# Altium project HVPowerModule.PrjPcb
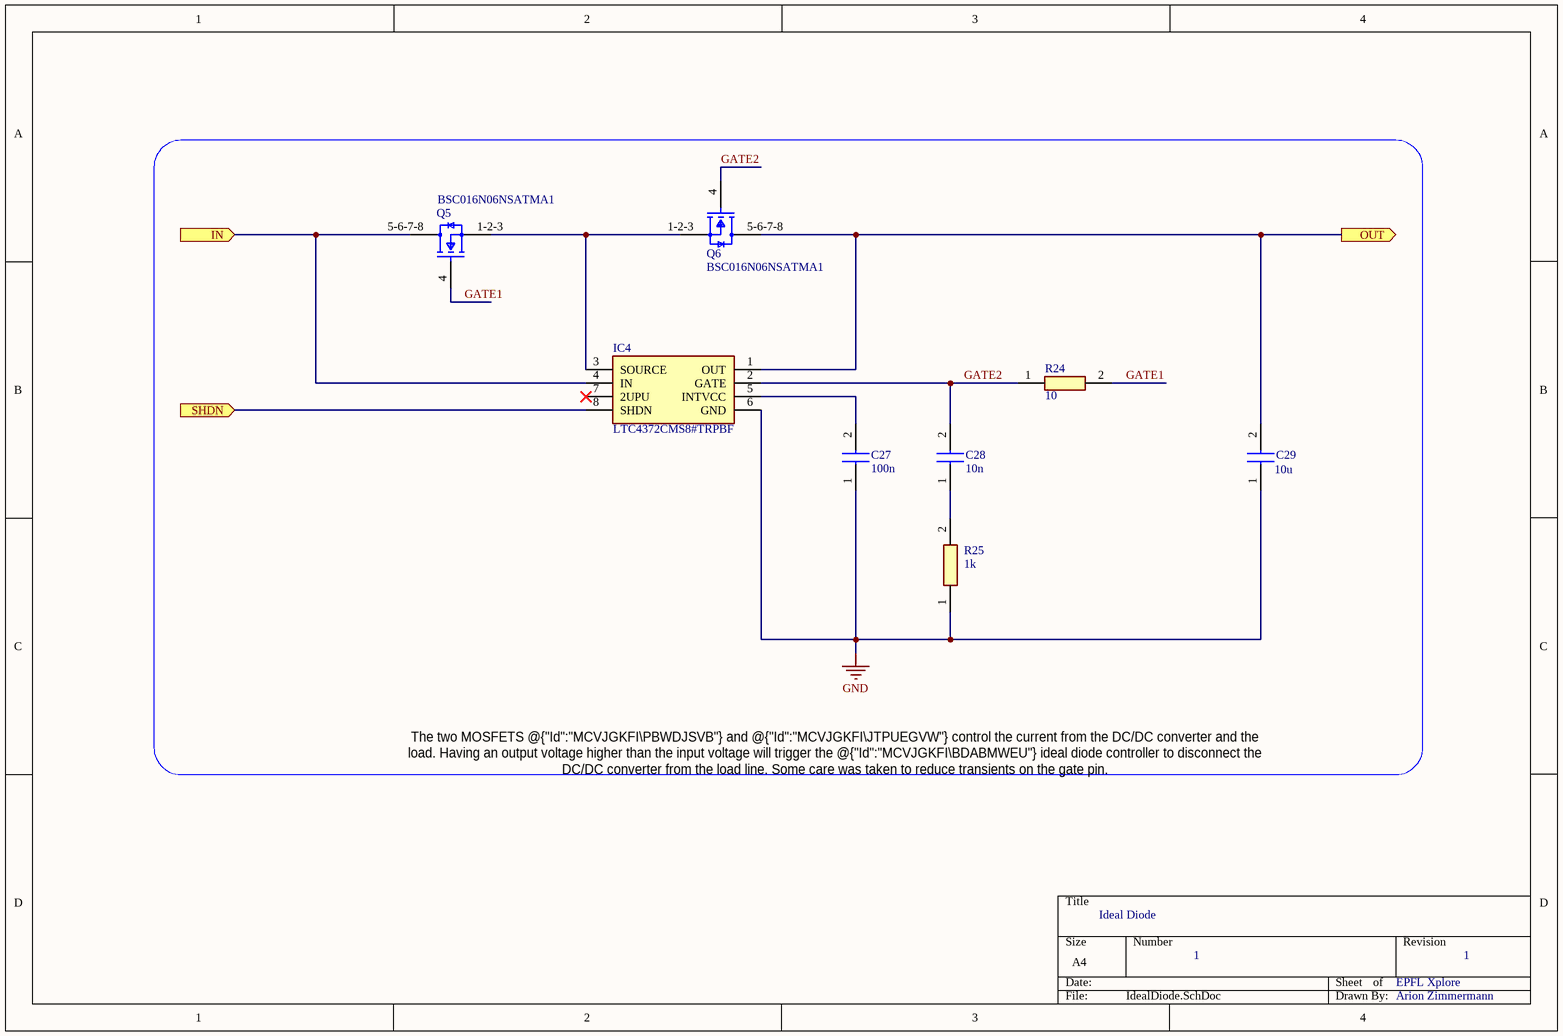
[diagram p0: IdealDiode.SchDoc]
3 sheets, 49 parts. Net scope: hierarchical (ports join the sheet entries above them; power ports are global).
Board file: HVPowerModule.PcbDoc
Sheets:
  IdealDiode.SchDoc
  DAC.SchDoc
  Converter.SchDoc

## Sheet IdealDiode.SchDoc
size A4; SheetNumber: 4; SheetTotal: 4

### Parts
C27  value 100n  [CAPC1608X95N]  (hidden comment: C0603C104K5RACTU)
C28  value 10n  [CAPC1608X95N]  (hidden comment: C0603C103K5RACTU)
C29  value 10u  [CAPC3225X230N]  (hidden comment: C3225X7R2A106K250AC)
IC4  LTC4372CMS8#TRPBF  [SOP65P490X110-8N]
Q5  BSC016N06NSATMA1  [FP-PG-TDSON-8-MFG]
Q6  BSC016N06NSATMA1  [FP-PG-TDSON-8-MFG]
R24  value 10  [RESC1608X55N]  (hidden comment: CRCW060310R0JNEAC)
R25  value 1k  [RESC1608X55N]  (hidden comment: CRCW06031K00FKECC)

### Ports
IN (in), OUT (out), SHDN (in)

### Nets
GND: C27.1 C29.1 IC4.6(GND) R25.1
GATE1: Q5.4(G) R24.2
GATE2: C28.2 IC4.2(GATE) Q6.4(G) R24.1
NetC27_2: C27.2 IC4.5(INTVCC)
NetC28_1: C28.1 R25.2
NetC29_2: C29.2 IC4.1(OUT) Q6.5-6-7-8(D) ; port OUT
NetIC4_3: IC4.3(SOURCE) Q5.1-2-3(S) Q6.1-2-3(S)
NetIC4_4: IC4.4(IN) Q5.5-6-7-8(D) ; port IN
NetIC4_8: IC4.8(SHDN) ; port SHDN

Not connected (* = marked no-connect by the designer): IC4 7(2UPU)*

### Notes on the sheet
- The two MOSFETS @{"Id":"MCVJGKFI\PBWDJSVB"} and @{"Id":"MCVJGKFI\JTPUEGVW"} control the current from the DC/DC converter and the load. Having an output voltage higher than the input voltage will trigger the @{"Id":"MCVJGKFI\BDABMWEU"} ideal diode controller to disconnect the DC/DC converter from the load line. Some care was taken to reduce transients on the gate pin.
- Ideal Diode
- 1
- EPFL Xplore
- Arion Zimmermann

### Library data of the parts
C27 C28 = C0603C104K5RACTU: Capacitor; Manufacturer_Name: Kemet; Datasheet Link: http://www.farnell.com/datasheets/2205446.pdf; Height: 0.95mm; Manufacturer_Part_Number: C0603C104K5RACTU; Mouser Part Number: 80-C0603C104K5R; Mouser Price/Stock: https://www.mouser.co.uk/ProductDetail/KEMET/C0603C104K5RACTU?qs=l5k%252BbMnNDkkVcnZPSAaaiQ%3D%3D; Arrow Part Number: C0603C104K5RACTU; Arrow Price/Stock: https://www.arrow.com/en/products/c0603c104k5ractu/kemet-corporation; Supplier 1: Mouser; Supplier Part Number 1: 80-C0603C104K5R
C29 = C3225X7R2A106K250AC: Capacitor; Manufacturer_Name: TDK; Datasheet Link: https://product.tdk.com/info/en/catalog/datasheets/mlcc_commercial_midvoltage_en.pdf; Height: 2.3mm; Manufacturer_Part_Number: C3225X7R2A106K250AC; Mouser Part Number: 810-C3225X7R2A106K25; Mouser Price/Stock: https://www.mouser.co.uk/ProductDetail/TDK/C3225X7R2A106K250AC?qs=rSMjJ%252B1ewcQNu1nTZev8UA%3D%3D
IC4 = LTC4372CMS8#TRPBF: Integrated Circuit; Manufacturer_Name: Analog Devices; Datasheet Link: https://www.arrow.com/en/products/ltc4372cms8trpbf/analog-devices; Height: 1.1mm; Manufacturer_Part_Number: LTC4372CMS8#TRPBF; Mouser Part Number: 584-LTC4372CMS8TRPBF; Mouser Price/Stock: https://www.mouser.co.uk/ProductDetail/Analog-Devices/LTC4372CMS8TRPBF?qs=T94vaHKWudSmRk6S7wUTVw%3D%3D; Arrow Part Number: LTC4372CMS8#TRPBF; Arrow Price/Stock: https://www.arrow.com/en/products/ltc4372cms8trpbf/analog-devices; Supplier 1: Mouser; Supplier Part Number 1: 584-LTC4372CMS8TRPBF
Q5 Q6 = CMP-32901-000166-1: MOSFET N-CH 60V 30A TDSON-8; Manufacturer: Infineon; Reverse Recovery Charge: 78nC; Power Dissipation: 2.5W; Transconductance: 140S; Gate Charge At Vgs: 71nC @ 10V; Turn On Delay Time: 19ns; Number Of Channels: 1; Typ Forward Diode Voltage: 0.9V; Depletion Mode: False; Max Forward Diode Voltage: 1.2V; Reverse Recovery Time: 61ns; Input Capacitace At Vds: 5200pF @ 30V; Gate To Source Voltage: 20V; Threshold Vgs Min: 2.1V; Drain To Source Resistance: 1.4mΩ; Turn Off Delay Time: 35ns; Threshold Vgs Max: 3.3V; Pulse Drain Current: 400A; Rthja Max: 50K/W; Max Junction Temp: +150°C; Temperature Range High: +150°C; Lead Free: Yes; ComponentLink2URL: https://www.infineon.com/dgdl/Infineon-BSC016N06NS-DS-v02_01-en.pdf?fileId=db3a3043353fdc160135532b353c483c; Device Class L2: Transistors; Drain To Source Voltage: 60V; ComponentLink2Description: Datasheet; Device Class L1: Discrete Semiconductors; Drain To Source Breakdown Voltage: 60V; Manufacturer Part Number: BSC016N06NSATMA1; Continuous Drain Current: 30A; Package: PG-TDSON-8; Octopart: https://octopart.com/bsc016n06nsatma1-infineon-23421881; Automotive: No; Temperature Range Low: -55°C; Footprint Url: https://www.infineon.com/cms/en/product/packages/PG-TDSON/PG-TDSON-8-17/; RoHS: TRUE; Number Of N Channels: 1; Temperature: -55°C to +150°C; Height: 1.1mm; Device Class L3: MOSFETs; Category: Trans; Digikey Description: MOSFET N-CH 60V 30A TDSON-8
R24 R25 = CRCW0603100RFKEBC: Resistor; Manufacturer_Name: Vishay; Datasheet Link: https://www.vishay.com/docs/28773/crcwce3.pdf; Height: 0.55mm; Manufacturer_Part_Number: CRCW0603100RFKEBC; Mouser Part Number: 71-CRCW0603100RFKEBC; Mouser Price/Stock: https://www.mouser.co.uk/ProductDetail/Vishay-Dale/CRCW0603100RFKEBC?qs=wd5RIQLrsJhdvQFtBw4oWg%3D%3D; Arrow Part Number: CRCW0603100RFKEBC; Arrow Price/Stock: https://www.arrow.com/en/products/crcw0603100rfkebc/vishay?region=nac

## Sheet DAC.SchDoc
size A4; SheetNumber: 3; SheetTotal: 4
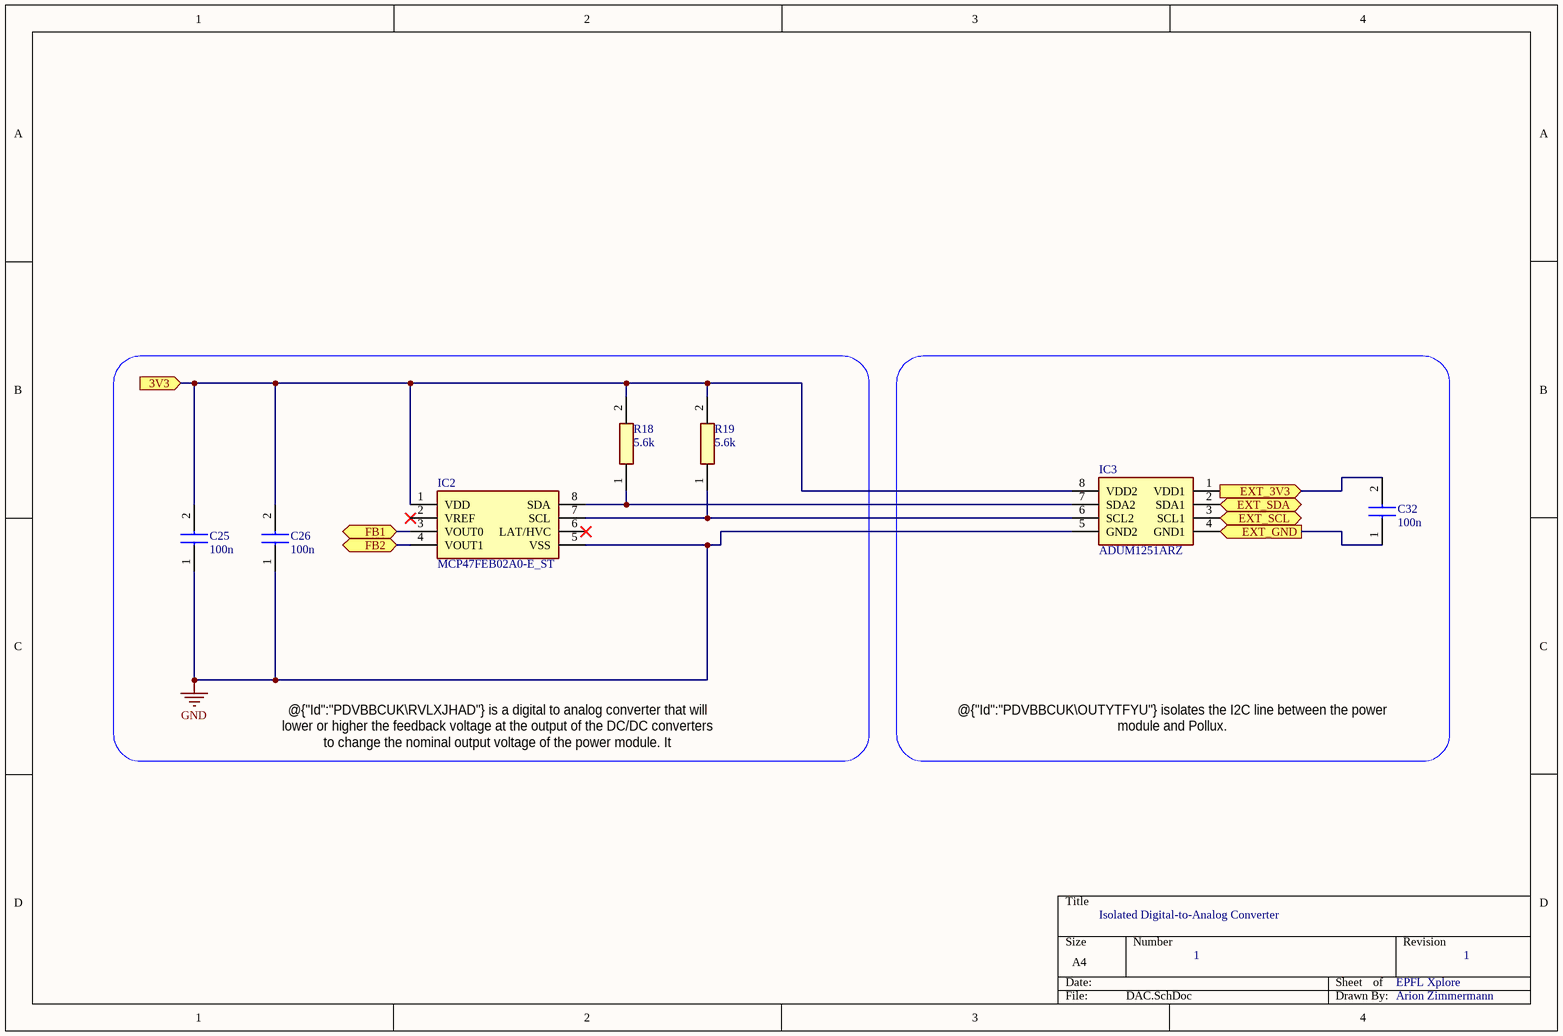
[diagram p1: DAC.SchDoc]

### Parts
(Parts that share a designator on the sheet are numbered #1, #2 ... from top to bottom, then left to right.)
C25  value 100n  [CAPC1608X95N]  (hidden comment: C0603C104K5RACTU)
C26#1  value 100n  [CAPC1608X95N]  (hidden comment: C0603C104K5RACTU)
C32  value 100n  [CAPC1608X95N]  (hidden comment: C0603C104K5RACTU)
IC2  MCP47FEB02A0-E_ST  [SOP65P640X120-8N]
IC3  ADUM1251ARZ  [SOIC127P600X175-8N]
R18  value 5.6k  [RESC1608X50N]  (hidden comment: CRCW06035K60JNEAC)
R19  value 5.6k  [RESC1608X50N]  (hidden comment: CRCW06035K60JNEAC)

### Ports
3V3 (in), EXT_3V3 (in), EXT_GND (out), EXT_SCL (bidir), EXT_SDA (bidir), FB1 (bidir), FB2 (bidir)

### Nets
GND: C25.1 C26#1.1 IC2.5(VSS) IC3.5(GND2)
NetC25_2: C25.2 C26#1.2 IC2.1(VDD) IC3.8(VDD2) R18.2 R19.2 ; port 3V3
NetC32_1: C32.1 IC3.4(GND1) ; port EXT_GND
NetC32_2: C32.2 IC3.1(VDD1) ; port EXT_3V3
NetIC2_3: IC2.3(VOUT0) ; port FB1
NetIC2_4: IC2.4(VOUT1) ; port FB2
NetIC2_7: IC2.7(SCL) IC3.6(SCL2) R19.1
NetIC2_8: IC2.8(SDA) IC3.7(SDA2) R18.1
NetIC3_2: IC3.2(SDA1) ; port EXT_SDA
NetIC3_3: IC3.3(SCL1) ; port EXT_SCL

Not connected (* = marked no-connect by the designer): IC2 2(VREF)* 6(LAT/HVC)*

### Notes on the sheet
- @{"Id":"PDVBBCUK\RVLXJHAD"} is a digital to analog converter that will lower or higher the feedback voltage at the output of the DC/DC converters to change the nominal output voltage of the power module. It communicates with I2C to Pollux.
- @{"Id":"PDVBBCUK\OUTYTFYU"} isolates the I2C line between the power module and Pollux.
- Isolated Digital-to-Analog Converter
- 1
- EPFL Xplore
- Arion Zimmermann

### Library data of the parts
C25 C26#1 C32 = C0603C104K5RACTU: Capacitor; Manufacturer_Name: Kemet; Datasheet Link: http://www.farnell.com/datasheets/2205446.pdf; Height: 0.95mm; Manufacturer_Part_Number: C0603C104K5RACTU; Mouser Part Number: 80-C0603C104K5R; Mouser Price/Stock: https://www.mouser.co.uk/ProductDetail/KEMET/C0603C104K5RACTU?qs=l5k%252BbMnNDkkVcnZPSAaaiQ%3D%3D; Arrow Part Number: C0603C104K5RACTU; Arrow Price/Stock: https://www.arrow.com/en/products/c0603c104k5ractu/kemet-corporation; Supplier 1: Mouser; Supplier Part Number 1: 80-C0603C104K5R
IC2 = MCP47FEB02A0-E_ST: Integrated Circuit; Manufacturer_Name: Microchip; Manufacturer_Part_Number: MCP47FEB02A0-E/ST; Datasheet Link: http://www.microchip.com/mymicrochip/filehandler.aspx?ddocname=en573220; Height: 1.2mm; Mouser Part Number: 579-MCP47FEB02A0EST; Mouser Price/Stock: https://www.mouser.co.uk/ProductDetail/Microchip-Technology/MCP47FEB02A0-E-ST?qs=rQCxX1QmdjKDJonwz1QvmA%3D%3D; Arrow Part Number: MCP47FEB02A0-E/ST; Arrow Price/Stock: https://www.arrow.com/en/products/mcp47feb02a0-est/microchip-technology?region=nac
IC3 = ADUM1251ARZ: Integrated Circuit; Manufacturer_Name: Analog Devices; Datasheet Link: https://datasheet.datasheetarchive.com/originals/distributors/Datasheets-DGA3/264898.pdf; Height: 1.75mm; Manufacturer_Part_Number: ADUM1251ARZ; Mouser Part Number: 584-ADUM1251ARZ; Mouser Price/Stock: https://www.mouser.co.uk/ProductDetail/Analog-Devices/ADUM1251ARZ?qs=WIvQP4zGani5W7Ldr0QsZA%3D%3D; Arrow Part Number: ADUM1251ARZ; Arrow Price/Stock: https://www.arrow.com/en/products/adum1251arz/analog-devices?region=nac; Supplier 1: Mouser; Supplier Part Number 1: 584-ADUM1251ARZ
R18 R19 = CRCW06035K62FKEB: Resistor; Manufacturer_Name: Vishay; Datasheet Link: http://www.vishay.com/docs/20035/dcrcwe3.pdf; Height: 0.5mm; Manufacturer_Part_Number: CRCW06035K62FKEB; Mouser Part Number: 71-CRCW06035K62FKEB; Mouser Price/Stock: https://www.mouser.co.uk/ProductDetail/Vishay-Dale/CRCW06035K62FKEB?qs=P6ImCWcZKGBvDktlVJxa7w%3D%3D; Supplier 1: Mouser; Supplier Part Number 1: 71-CRCW06035K60JNEAC

## Sheet Converter.SchDoc
size A4; SheetNumber: 4; SheetTotal: 4
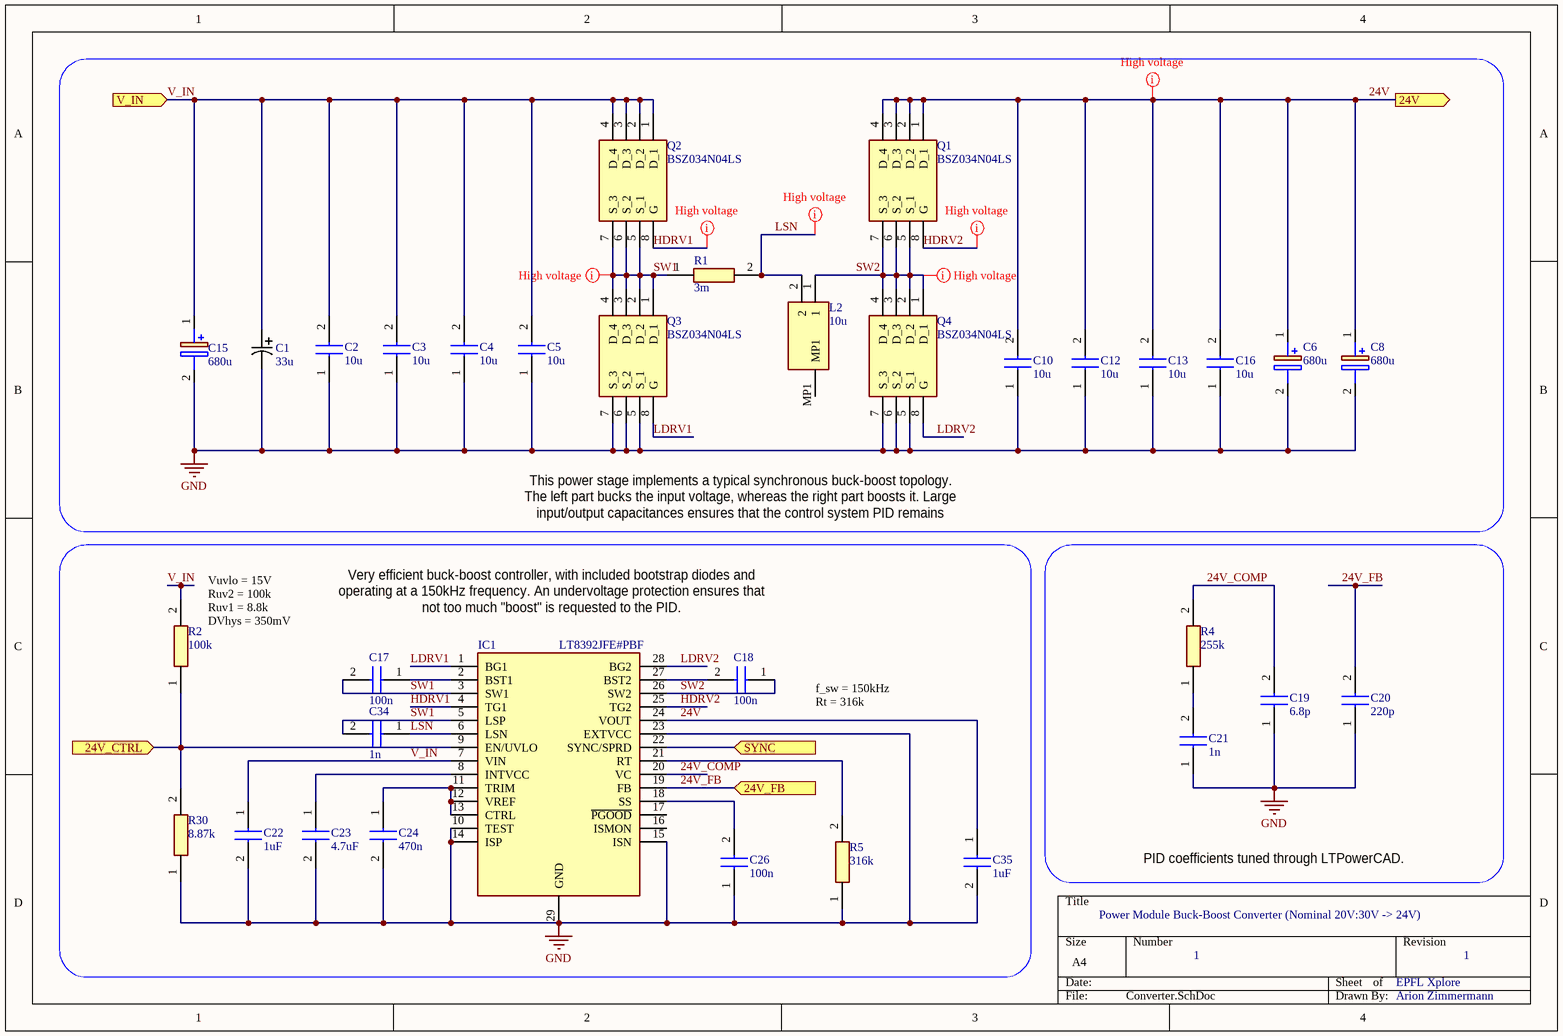
[diagram p2: Converter.SchDoc]

### Parts
(Parts that share a designator on the sheet are numbered #1, #2 ... from top to bottom, then left to right.)
C1  value 33u  [CAPMP7.6X4.3_3.1N_KEM]  (hidden comment: T598D336M035ATE065)
C2  value 10u  [CAPC3225X280N]  (hidden comment: CGA6P1X7R1N106M250AC)
C3  value 10u  [CAPC3225X280N]  (hidden comment: CGA6P1X7R1N106M250AC)
C4  value 10u  [CAPC3225X280N]  (hidden comment: CGA6P1X7R1N106M250AC)
C5  value 10u  [CAPC3225X280N]  (hidden comment: CGA6P1X7R1N106M250AC)
C6  value 680u  [CAPPRD500W65D1000H1800]  (hidden comment: A750MW687M1VAAE018)
C8  value 680u  [CAPPRD500W65D1000H1800]  (hidden comment: A750MW687M1VAAE018)
C10  value 10u  [CAPC3225X280N]  (hidden comment: CGA6P1X7R1N106M250AC)
C12  value 10u  [CAPC3225X280N]  (hidden comment: CGA6P1X7R1N106M250AC)
C13  value 10u  [CAPC3225X280N]  (hidden comment: CGA6P1X7R1N106M250AC)
C15  value 680u  [CAPPRD500W65D1000H1800]  (hidden comment: A750MW687M1VAAE018)
C16  value 10u  [CAPC3225X280N]  (hidden comment: CGA6P1X7R1N106M250AC)
C17  value 100n  [CAPC1608X95N]  (hidden comment: C0603C104K5RACTU)
C18  value 100n  [CAPC1608X95N]  (hidden comment: C0603C104K5RACTU)
C19  value 6.8p  [CAPC1608X87N]  (hidden comment: C0603C689C5GACTU)
C20  value 220p  [CAPC1608X87N]  (hidden comment: C0603C221K5RACTU)
C21  value 1n  [CAPC1608X95N]  (hidden comment: C0603C102J5RACTU)
C22  value 1uF  [CAPC3216X130N]  (hidden comment: C1206C105M5RECTU)
C23  value 4.7uF  [CAPC3316X195N]  (hidden comment: C1206X475M5RACAUTO)
C24  value 470n  [CAPC1608X90N]  (hidden comment: C0603C474K4PACTU)
C26#2  value 100n  [CAPC1608X95N]  (hidden comment: C0603C104K5RACTU)
C34  value 1n  [CAPC1608X95N]  (hidden comment: C0603C102J5RACTU)
C35  value 1uF  [CAPC3216X130N]  (hidden comment: C1206C105M5RECTU)
IC1  LT8392JFE#PBF  [SOP65P640X120-29N]
L2  value 10u  [PQ2614BLA1R0K]  (hidden comment: PQ2614BHA-100K)
Q1  BSZ034N04LS  [BSZ060NE2LS]
Q2  BSZ034N04LS  [BSZ060NE2LS]
Q3  BSZ034N04LS  [BSZ060NE2LS]
Q4  BSZ034N04LS  [BSZ060NE2LS]
R1  value 3m  [RESC3216X68N]  (hidden comment: PCS1206FR0030ET)
R2  value 100k  [RESC1608X55N]  (hidden comment: CRCW0603100KJNEAC)
R4  value 255k  [RESC1608X50N]  (hidden comment: CRCW0603255KFKEAC)
R5  value 316k  [RESC1608X50N]  (hidden comment: CRCW0603316KFKTA)
R30  value 8.87k  [RESC1608X50N]  (hidden comment: CRCW06038K87FKTA)

### Ports
24V (out), 24V_CTRL (in), 24V_FB (in), SYNC (in), V_IN (in)

### Nets
GND: C1.2 C2.1 C3.1 C4.1 C5.1 C6.2(-) C8.2(-) C10.1 C12.1 C13.1 C15.2(-) C16.1 C19.1 C20.1 C21.1 C22.2 C23.2 C24.2 C26#2.1 C35.2 IC1.10(TEST) IC1.14(ISP) IC1.15(ISN) IC1.23(EXTVCC) IC1.29(GND) Q3.5(S_1) Q3.6(S_2) Q3.7(S_3) Q4.5(S_1) Q4.6(S_2) Q4.7(S_3) R5.1 R30.1
24V: C6.1(+) C8.1(+) C10.2 C12.2 C13.2 C16.2 C35.1 IC1.24(VOUT) Q1.1(D_1) Q1.2(D_2) Q1.3(D_3) Q1.4(D_4) ; port 24V
24V_COMP: C19.2 IC1.20(VC) R4.2
24V_FB: C20.2 IC1.19(FB) ; port 24V_FB
HDRV1: IC1.4(TG1) Q2.8(G)
HDRV2: IC1.25(TG2) Q1.8(G)
LDRV1: IC1.1(BG1) Q3.8(G)
LDRV2: IC1.28(BG2) Q4.8(G)
LSN: C34.1 IC1.6(LSN) L2.2 R1.2
SW1: C17.2 C34.2 IC1.3(SW1) IC1.5(LSP) Q2.5(S_1) Q2.6(S_2) Q2.7(S_3) Q3.1(D_1) Q3.2(D_2) Q3.3(D_3) Q3.4(D_4) R1.1
SW2: C18.1 IC1.26(SW2) L2.1 Q1.5(S_1) Q1.6(S_2) Q1.7(S_3) Q4.1(D_1) Q4.2(D_2) Q4.3(D_3) Q4.4(D_4)
V_IN: C1.1 C2.2 C3.2 C4.2 C5.2 C15.1(+) C22.1 IC1.7(VIN) Q2.1(D_1) Q2.2(D_2) Q2.3(D_3) Q2.4(D_4) R2.2 ; port V_IN
NetC17_1: C17.1 IC1.2(BST1)
NetC18_2: C18.2 IC1.27(BST2)
NetC21_2: C21.2 R4.1
NetC23_1: C23.1 IC1.8(INTVCC)
NetC24_1: C24.1 IC1.11(TRIM) IC1.12(VREF) IC1.13(CTRL)
NetC26#2_2: C26#2.2 IC1.18(SS)
NetIC1_9: IC1.9(EN/UVLO) R2.1 R30.2 ; port 24V_CTRL
NetIC1_21: IC1.21(RT) R5.2
NetIC1_22: IC1.22(SYNC/SPRD) ; port SYNC

Not connected (* = marked no-connect by the designer): IC1 16(ISMON) 17(~{PGOOD}); L2 MP1

### Layout directives
net class HV1: SW1
net class HV: 24V, HDRV1, HDRV2, SW2
net class HV2: LSN

### Notes on the sheet
- This power stage implements a typical synchronous buck-boost topology. The left part bucks the input voltage, whereas the right part boosts it. Large input/output capacitances ensures that the control system PID remains stable.
- (near R2) Vuvlo = 15V
  Ruv2 = 100k
  Ruv1 = 8.8k
  DVhys = 350mV
- Very efficient buck-boost controller, with included bootstrap diodes and operating at a 150kHz frequency. An undervoltage protection ensures that not too much "boost" is requested to the PID.
- f_sw = 150kHz
  Rt = 316k
- PID coefficients tuned through LTPowerCAD.
- Power Module Buck-Boost Converter (Nominal 20V:30V -> 24V)
- 1
- EPFL Xplore
- Arion Zimmermann

### Library data of the parts
C1 = T598D336M035ATE065: No Description Available; Vendor: Kemet; SourceLibrary: Kemet_2020-03-25_3; Built_By: EMA_Frank; Source_Library: Kemet_2020-03-25_3.xlr; Type: DEV; Manufacturer_Part_Number: T598D336M035ATE065; Copyright: Copyright (C) 2018 Accelerated Designs. All rights reserved; RefDes: RefDes; Supplier 1: Mouser; Supplier Part Number 1: 80-T598D336M35E65
C2-C5 C10 C12 C13 C16 = CGA6P1X7R1N106M250AC: Capacitor; Manufacturer_Name: TDK; Datasheet Link: https://product.tdk.com/system/files/dam/doc/product/capacitor/ceramic/mlcc/catalog/mlcc_automotive_general_en.pdf; Height: 2.8mm; Manufacturer_Part_Number: CGA6P1X7R1N106M250AC; Mouser Part Number: 810-CGA6P1X7R1N106M; Mouser Price/Stock: https://www.mouser.co.uk/ProductDetail/TDK/CGA6P1X7R1N106M250AC?qs=gZXFycFWdANNyXbiENuK8Q%3D%3D; Arrow Part Number: CGA6P1X7R1N106M250AC; Arrow Price/Stock: https://www.arrow.com/en/products/cga6p1x7r1n106m250ac/tdk; Supplier 1: Mouser; Supplier Part Number 1: 810-CGA6P1X7R1N106M
C6 C8 C15 = A750MW687M1VAAE018: Capacitor Polarised; Manufacturer_Name: Kemet; Datasheet Link: https://www.kemet.com/specsheet/A750MW687M1VAAE018; Height: 18mm; Manufacturer_Part_Number: A750MW687M1VAAE018
  C6 C8: Supplier 1: Mouser; Supplier Part Number 1: 80-A750MW687M1VAAE18
C17 C18 C21 C26#2 C34 = C0603C104K5RACTU: Capacitor; Manufacturer_Name: Kemet; Datasheet Link: http://www.farnell.com/datasheets/2205446.pdf; Height: 0.95mm; Manufacturer_Part_Number: C0603C104K5RACTU; Mouser Part Number: 80-C0603C104K5R; Mouser Price/Stock: https://www.mouser.co.uk/ProductDetail/KEMET/C0603C104K5RACTU?qs=l5k%252BbMnNDkkVcnZPSAaaiQ%3D%3D; Arrow Part Number: C0603C104K5RACTU; Arrow Price/Stock: https://www.arrow.com/en/products/c0603c104k5ractu/kemet-corporation; Supplier 1: Mouser
  C17 C18 C26#2: Supplier Part Number 1: 80-C0603C104K5R
  C21 C34: Supplier Part Number 1: 80-C0603C102J5R
C19 = C0603C689C5GACTU: Capacitor; Manufacturer_Name: Kemet; Datasheet Link: https://datasheet.datasheetarchive.com/originals/distributors/SFDatasheet-4/sf-00083929.pdf; Height: 0.87mm; Manufacturer_Part_Number: C0603C689C5GACTU; Mouser Part Number: 80-C0603C689C5G; Mouser Price/Stock: https://www.mouser.com/Search/Refine.aspx?Keyword=80-C0603C689C5G; Arrow Part Number: C0603C689C5GACTU; Arrow Price/Stock: https://www.arrow.com/en/products/c0603c689c5gactu/kemet-corporation; Supplier 1: Mouser; Supplier Part Number 1: 80-C0603C689C5G
C20 = C0603C221K5RACTU: Capacitor; Manufacturer_Name: Kemet; Datasheet Link: https://componentsearchengine.com/Datasheets/2/C0603C221K5RACTU.pdf; Height: 0.87mm; Manufacturer_Part_Number: C0603C221K5RACTU; Mouser Part Number: 80-C0603C221K5R; Mouser Price/Stock: https://www.mouser.co.uk/ProductDetail/KEMET/C0603C221K5RACTU?qs=mvqbjrnDhCzYtgiRXquOuQ%3D%3D; Arrow Part Number: C0603C221K5RACTU; Arrow Price/Stock: https://www.arrow.com/en/products/c0603c221k5ractu/kemet-corporation; Supplier 1: Mouser; Supplier Part Number 1: 80-C0603C221K5R
C22 C35 = C1206C105M5RECTU: Capacitor; Manufacturer_Name: Kemet; Datasheet Link: https://content.kemet.com/datasheets/KEM_C1090_X7R_ESD.pdf; Height: 1.3mm; Manufacturer_Part_Number: C1206C105M5RECTU; Mouser Part Number: 80-C1206C105M5RECTU; Mouser Price/Stock: https://www.mouser.co.uk/ProductDetail/KEMET/C1206C105M5RECTU?qs=55YtniHzbhBh39CxZCw85g%3D%3D; Arrow Part Number: C1206C105M5RECTU; Arrow Price/Stock: https://www.arrow.com/en/products/c1206c105m5rectu/kemet-corporation; Supplier 1: Mouser; Supplier Part Number 1: 80-C1206C105M5RECTU
C23 = C1206X475M5RACAUTO: Capacitor; Manufacturer_Name: Kemet; Datasheet Link: https://www.kemet.com/specsheet/C1206X475M5RACAUTO; Height: 1.95mm; Manufacturer_Part_Number: C1206X475M5RACAUTO; Mouser Part Number: 80-C1206X475M5RAUTO; Mouser Price/Stock: https://www.mouser.co.uk/ProductDetail/KEMET/C1206X475M5RACAUTO?qs=%252B6g0mu59x7LXtOZABrHA3A%3D%3D; Supplier 1: Mouser; Supplier Part Number 1: 80-C1206X475M5RAUTO
C24 = C0603C474K4PACTU: Capacitor; Manufacturer_Name: Kemet; Datasheet Link: https://www.kemet.com/specsheet/C0603C474K4PACTU; Height: 0.9mm; Manufacturer_Part_Number: C0603C474K4PACTU; Mouser Part Number: 80-C0603C474K4P; Mouser Price/Stock: https://www.mouser.co.uk/ProductDetail/KEMET/C0603C474K4PACTU?qs=IOSO19fP00rNDeTfy1w%2Frw%3D%3D; Arrow Part Number: C0603C474K4PACTU; Arrow Price/Stock: https://www.arrow.com/en/products/c0603c474k4pactu/kemet-corporation?region=nac; Supplier 1: Mouser; Supplier Part Number 1: 80-C0603C474K4P
IC1 = LT8392JFE#PBF: Integrated Circuit; Manufacturer_Name: Analog Devices; Datasheet Link: https://www.mouser.co.uk/datasheet/2/609/lt8392-1921917.pdf; Height: 1.2mm; Manufacturer_Part_Number: LT8392JFE#PBF; Mouser Part Number: 584-LT8392JFE#PBF; Mouser Price/Stock: https://www.mouser.co.uk/ProductDetail/Analog-Devices/LT8392JFEPBF?qs=zW32dvEIR3v19WKL6cpYug%3D%3D; Supplier 1: Mouser; Supplier Part Number 1: 584-LT8392JFE#PBF
L2 = PQ2614BHA-100K: Inductor; Manufacturer_Name: Bourns; Datasheet Link: https://www.bourns.com/docs/Product-Datasheets/PQ2614.pdf; Height: 16mm; Manufacturer_Part_Number: PQ2614BHA-100K; Mouser Part Number: 652-PQ2614BHA-100K; Mouser Price/Stock: https://www.mouser.co.uk/ProductDetail/Bourns/PQ2614BHA-100K?qs=1mbolxNpo8cus7p6tzCJzA%3D%3D; Arrow Part Number: PQ2614BHA-100K; Arrow Price/Stock: https://www.arrow.com/en/products/pq2614bha-100k/bourns?region=nac; Supplier 1: Mouser; Supplier Part Number 1: 652-PQ2614BHA-100K
Q1-Q4 = BSZ034N04LS: MOSFET (N-Channel); Manufacturer_Name: Infineon; Datasheet Link: https://www.infineon.com/dgdl/Infineon-BSZ034N04LS-DS-v02_01-EN.pdf?fileId=db3a304342371bb001424c3fe5bc7083; Manufacturer_Part_Number: BSZ034N04LS; Mouser Part Number: 726-BSZ034N04LS; Mouser Price/Stock: https://www.mouser.co.uk/ProductDetail/Infineon-Technologies/BSZ034N04LS?qs=y2kkmE52mdOs9jAiLVqcEw%3D%3D; Supplier 1: Mouser; Supplier Part Number 1: 726-BSZ034N04LS
R1 = PCS1206FR0030ET: Resistor; Manufacturer_Name: Ohmite; Datasheet Link: https://componentsearchengine.com/Datasheets/2/PCS1206FR0030ET.pdf; Height: 0.684mm; Manufacturer_Part_Number: PCS1206FR0030ET; Mouser Part Number: 588-PCS1206FR0030ET; Mouser Price/Stock: https://www.mouser.co.uk/ProductDetail/Ohmite/PCS1206FR0030ET?qs=Zz7%252BYVVL6bGHVp6IC0W8ig%3D%3D; Supplier 1: Mouser; Supplier Part Number 1: 588-PCS1206FR0030ET
R2 = CRCW0603100KFKEAC: Resistor; Manufacturer_Name: Vishay; Datasheet Link: https://www.mouser.com/datasheet/2/427/crcwce3-1223726.pdf; Height: 0.55mm; Manufacturer_Part_Number: CRCW0603100KFKEAC; Mouser Part Number: 71-CRCW0603100KFKEAC; Mouser Price/Stock: https://www.mouser.co.uk/ProductDetail/Vishay-Dale/CRCW0603100KFKEAC?qs=E3Y5ESvWgWPxzfNYyMgX1w%3D%3D; Arrow Part Number: CRCW0603100KFKEAC; Arrow Price/Stock: https://www.arrow.com/en/products/crcw0603100kfkeac/vishay; Supplier 1: Mouser; Supplier Part Number 1: 71-CRCW0603100KJNEAC
R4 R5 = CRCW0603316KFKTA: Resistor; Manufacturer_Name: Vishay; Datasheet Link: http://www.vishay.com/docs/20035/dcrcwe3.pdf; Height: 0.5mm; Manufacturer_Part_Number: CRCW0603316KFKTA; Mouser Part Number: 71-CRCW0603-316K; Mouser Price/Stock: https://www.mouser.co.uk/ProductDetail/Vishay-Dale/CRCW0603316KFKTA?qs=rSCQ%2F9oRLB67bniFfnYAjQ%3D%3D; Supplier 1: Mouser
  R4: Supplier Part Number 1: 71-CRCW0603255KFKEAC
  R5: Supplier Part Number 1: 71-CRCW0603-316K
R30 = CRCW06038K87FKEA: Resistor; Manufacturer_Name: Vishay; Datasheet Link: http://www.vishay.com/docs/20035/dcrcwe3.pdf; Height: 0.5mm; Manufacturer_Part_Number: CRCW06038K87FKEA; Mouser Part Number: 71-CRCW0603-8.87K-E3; Mouser Price/Stock: https://www.mouser.co.uk/ProductDetail/Vishay-Dale/CRCW06038K87FKEA/?qs=CuWZN%2F5Vbiq36sz1Lp02wA%3D%3D; Arrow Part Number: CRCW06038K87FKEA; Arrow Price/Stock: https://www.arrow.com/en/products/crcw06038k87fkea/vishay; Supplier 1: Mouser; Supplier Part Number 1: 71-CRCW0603-8.87K

## Nets that join several sheets
GND: IdealDiode (C27.1 C29.1 IC4.6 R25.1), DAC (C25.1 C26#1.1 IC2.5 IC3.5), Converter (33 pins)